# EAGLE design MUV_Interface_pcb (EAGLE 9.1.3)

## Sheet 1 of 2
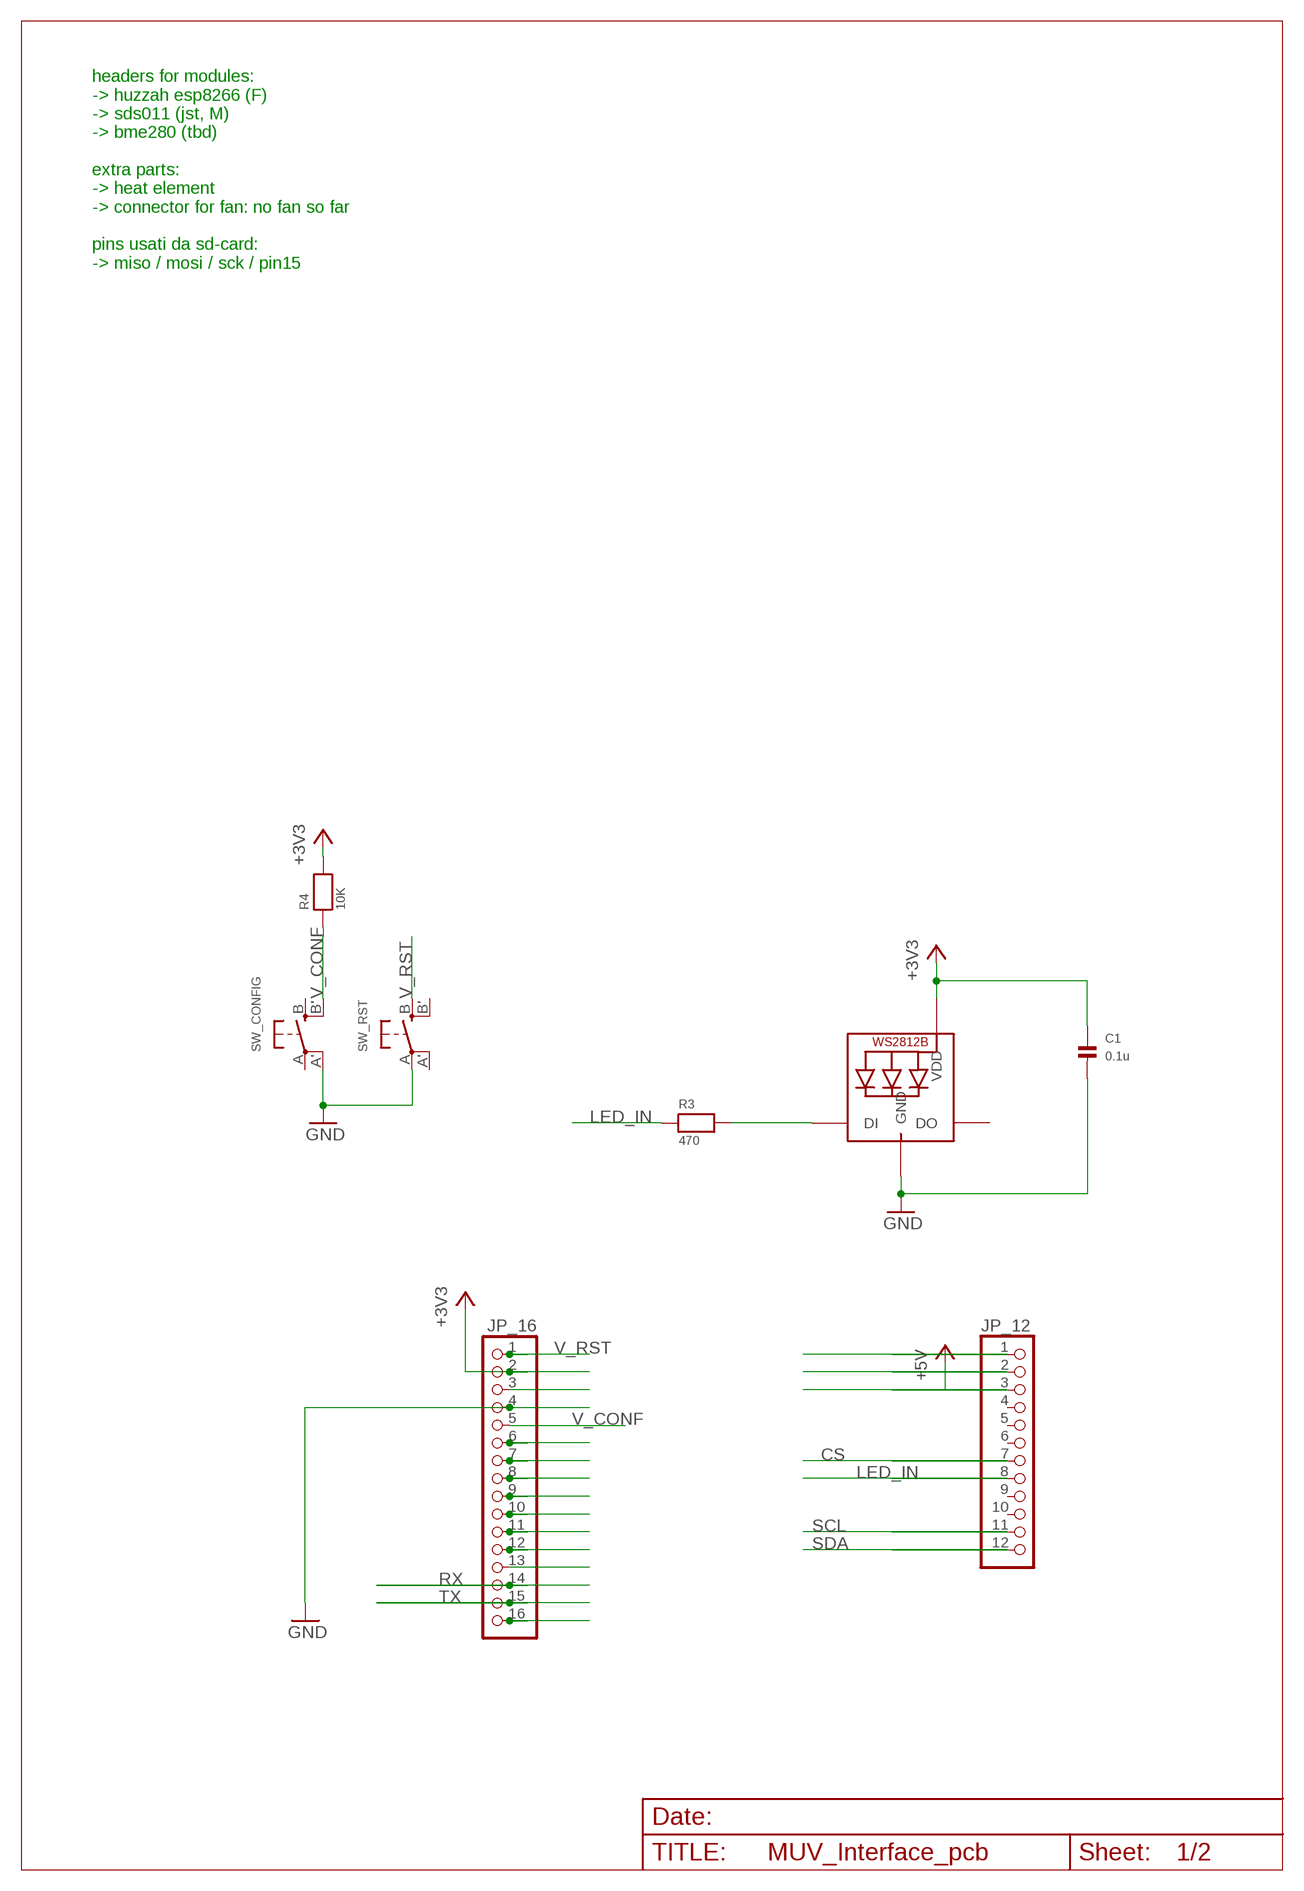
[diagram p0: schematic, sheet 1]

### Parts
C1  0.1u  CAP_CERAMIC1206  [1206]
JP_12  HEADER-1X12OVAL  [1X12_OVAL]
JP_16  HEADER-1X16  [1X16_OVAL]
LED1  WS2812B5050  [WS2812B]
R3  470  RESISTOR1206  [1206]
R4  10K  RESISTOR1206  [1206]
SW_CONFIG  SWITCH_TACT_SMT  [EVQ-Q2]
SW_RST  SWITCH_TACT_SMT  [EVQ-Q2]

### Nets
+3V3 [power]: C1.1 JP_16.2 LED1.1-VDD(VDD) R4.2
+5V [power_5V]: JP_12.3
CS: JP_12.7
GND [power]: C1.2 JP_16.4 LED1.3-GND(GND) SW_CONFIG.A'(P1) SW_RST.A(P)
LED_IN: JP_12.8 R3.1
N$1: JP_12.1
N$2: JP_12.2
N$3: LED1.4-DIN(DI) R3.2
N$11: JP_16.3
N$13: JP_16.6
N$14: JP_16.7
N$17: JP_16.8
N$18: JP_16.9
N$19: JP_16.10
N$20: JP_16.11
N$21: JP_16.12
N$22: JP_16.13
N$23: JP_16.16
RX: JP_16.14
SCL: JP_12.11
SDA: JP_12.12
TX: JP_16.15
V_CONF: JP_16.5 R4.1 SW_CONFIG.B'(S1)
V_RST: JP_16.1 SW_RST.B(S)
Unconnected: JP_12.4 JP_12.5 JP_12.6 JP_12.9 JP_12.10 LED1.2-DOUT(DO) SW_CONFIG.A(P) SW_CONFIG.B(S) SW_RST.A'(P1) SW_RST.B'(S1)

### Notes on the sheet
- headers for modules:
  -> huzzah esp8266 (F)
  -> sds011 (jst, M)
  -> bme280 (tbd)
  
  extra parts:
  -> heat element
  -> connector for fan: no fan so far
  
  pins usati da sd-card:
  -> miso / mosi / sck / pin15

## Sheet 2 of 2

## Library data of the parts
C1 = microbuilder:CAP_CERAMIC: Ceramic Capacitors 0402 - 0402 Surface Mount Capacitors 16pF 50V 5% [Digikey: 445-4899-2-ND] 18pF 50V 5% [Digikey: 490-1281-2-ND] 22pF 50V 5% [Digikey: 490-1283-2-ND] 68pF 50V 5% [Digikey: 490-1289-2-ND] 0.1uF 10V 10% [Digikey: 490-1318-2-ND] 1.0uF 6.3V 10% [Digikey: 490-1320-2-ND] 0603 - 0603 Surface Mount Capacitors 16 pF 50V 5% [Digikey: 445-5051-2-ND] 22 pF 50V [Digikey: PCC220ACVTR-ND] 33 pF 50V 5% [Digikey: 490-1415-1-ND] 56pF 50V 5% [Digikey: 490-1421-1-ND] 220pF 50V 5% [Digikey: 445-1285-1-ND] 680 pF 50V 2200 pF 50V 5% C0G [Digikey: 445-1297-1-ND] 5600 pF 100V 5% X7R [Digikey: 478-3711-1-ND] 0.1 µF 25V 10% [Digikey: PCC2277TR-ND] 0.22 µF 16V 10% X7R [Digikey: 445-1318-1-ND] 1.0 µF 25V 10% [Digikey: 445-5146-2-ND] 0603 - RF Specific 3pF 250V +/-0.1pF RF [Digikey: 712-1347-1-ND] 18 pF 250V 5% [Digikey: 478-3505-1-ND or 712-1322-1-ND] 56 pF 250V 5% C0G RF [Digikey: 490-4867-1-ND] 68 pF 250V RF [Digikey: 490-4868-1-ND] 0805 - 0805 Surface Mount Capacitors 220 pF 250V 2% RF Ceramic Capacitor [Digikey: 712-1398-1-ND] 1000 pF 50V 2% NP0 Ceramic Capacitor [Digikey: 478-3760-1-ND] 0.1 µF 25V 10% Ceramic Capacitor [Digikey: PCC1828TR-ND] 1.0 µF 16V 10% Ceramic Capacitor[Digikey: 490-1691-2-ND] 10.0 µF 10V 10% Ceramic Capacitor[Digikey: 709-1228-1-ND] 10.0 uF 16V 10% Ceramic Capacitor [Digikey: 478-5165-2-ND] 47 uF 6.3V 20% Ceramic Capacitor [Digikey: 587-1779-1-ND or 399-5506-1-ND] 1206 - 1206 Surface Mount Capacitors 47uF 10V 20% Ceramic Capacitor [Digikey: 490-5528-1-ND or 399-5508-1-ND or 445-6010-1-ND] 100uF 6.3V -20%, +80% Y5V Ceramic Capacitor (Digikey: 490-4512-1-ND, Mouser: 81-GRM31CF50J107ZE1L)
JP_12 = headers:HEADER-1X12
JP_16 = headers:HEADER-1X16: PIN HEADER
LED1 = adafruit:WS2812B
R3 R4 = microbuilder:RESISTOR: Resistors 0402 - 0402 Surface Mount Package 22 Ohm 1% 1/16W [Digikey: 311-22.0LRTR-ND] 33 Ohm 5% 1/16W 1.0K 5% 1/16W 1.5K 5% 1/16W 2.0K 1% 1/16W 10.0K 1% 1/16W [Digikey: 311-10.0KLRTR-ND] 10.0K 5% 1/16W [Digikey: RMCF0402JT10K0TR-ND] 12.1K 1% 1/16W [Digikey: 311-22.0LRTR-ND] 100.0K 5% 1/16W 0603 - 0603 Surface Mount Package 0 Ohm 1/10 Watt 1% Resistor 15 Ohm 1/10 Watt 1% Resistor 33 Ohm 1/10 Watt 1% Resistor 49.9 Ohm 1/10 Watt 1% Resistor 100 Ohm 1/10 Watt 1% Resistor 150 Ohm 1/10 Watt 1% Resistor 240 Ohm 1/10 Watt 1% Resistor 390 Ohm 1/10 Watt 1% Resistor 560 Ohm 1/10 Watt 1% Resistor 680 Ohm 1/10 Watt 1% Resistor 750 Ohm 1/10 Watt 1% Resistor 1.0K Ohm 1/10 Watt 1% Resistor 1.5K Ohm 1/10 Watt 1% Resistor 2.0K Ohm 1/10 Watt 1% Resistor 2.2K Ohm 1/10 Watt 1% Resistor 3.3K Ohm 1/10 Watt 1% Resistor 4.7K Ohm 1/10 Watt 1% Resistor 10.0K Ohm 1/10 Watt 1% Resistor 12.0K Ohm 1/10 Watt 1% Resistor 12.1K Ohm 1/10 Watt 1% Resistor 20.0K Ohm 1/10 Watt 1% Resistor 33.0K Ohm 1/10 Watt 1% Resistor 100.0K Ohm 1/10 Watt 1% Resistor 0805 - 0805 Surface Mount Package 0 Ohm 1/8 Watt 1% Resistor 33 Ohm 1/8 Watt 1% Resistor 100 Ohm 1/8 Watt 1% Resistor 150 Ohm 1/8 Watt 1% Resistor 200 Ohm 1/8 Watt 1% Resistor 240 Ohm 1/8 Watt 1% Resistor 330 Ohm 1/8 Watt 1% Resistor 390 Ohm 1/8 Watt 1% Resistor 470 Ohm 1/8 Watt 1% Resistor 1.0K Ohm 1/8 Watt 1% Resistor 1.5K Ohm 1/8 Watt 1% Resistor 2.0K Ohm 1/8 Watt 1% Resistor 4.7K Ohm 1/8 Watt 1% Resistor 5.1K Ohm 1/8 Watt 1% Resistor 5.6K Ohm 1/8 Watt 1% Resistor 10.0K Ohm 1/8 Watt 1% Resistor 22.0K Ohm 1/8 Watt 1% Resistor 33.0K Ohm 1/8 Watt 1% Resistor 100K Ohm 1/8 Watt 1% Resistor 1206 - 1206 Surface Mount Package 2012 - 2010 Surface Mount Package 0.11 Ohm 1/2 Watt 1% Resistor - Digikey: RHM.11UCT-ND
SW_CONFIG SW_RST = microbuilder:SWITCH_TACT_SMT: SMT Tact Switches 6x6mm - Digikey: P12940SCT-ND KMR2 (4.6x2.8mm) - Digikey: 401-1426-1-ND EVQ-PQHB55 - Light Touch, 160GF (4.5x4.5mm) - Digikey: P8090SCT-ND

## Net classes
0 default: width 0.3 mm, clearance 0.4 mm
1 power: width 0.3 mm, clearance 0.4 mm
2 power_5V: width 1 mm

## Board
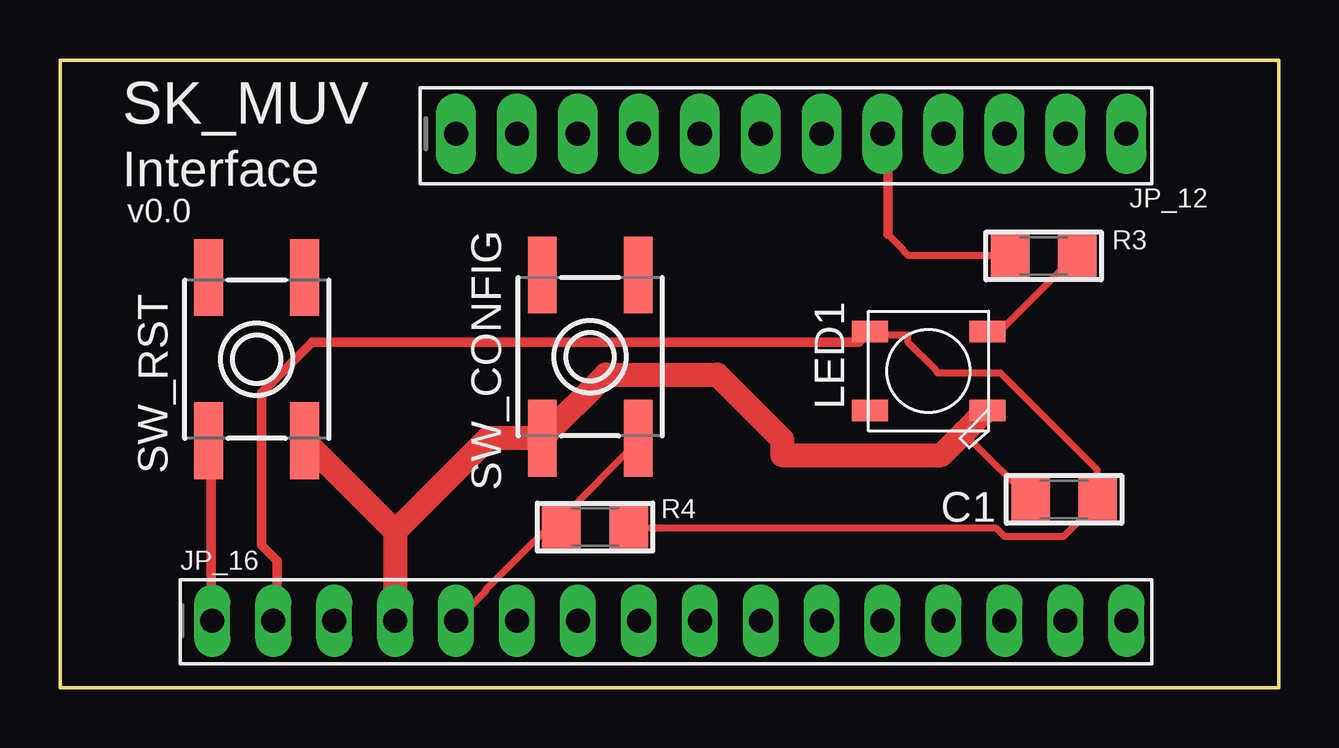
[diagram p1: board, top side]
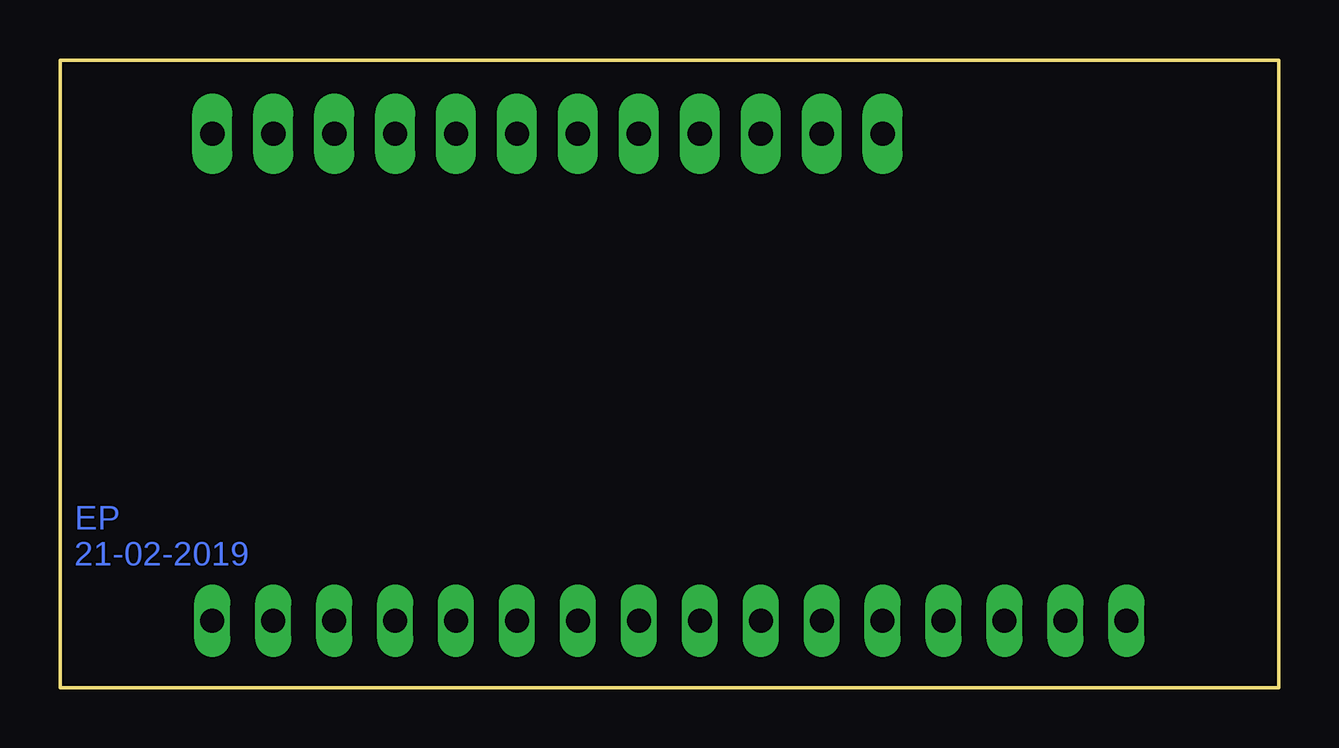
[diagram p2: board, bottom side, seen from below]

Size 50.8 x 26.16 mm. Coordinates in mm from the lower left corner, seen from the top.
Outline: 0,0 50.8,0
Outline: 0,0 0,23.37
Outline: 0,23.37 0,23.62
Outline: 0,23.37 0,26.16 50.8,26.16 50.8,0
Outline: 50.8,0 0,0
Copper layers (1*16): Top 0.035mm / dielectric 1.5mm / Bottom 0.035mm
Design rules "default *": minimum track width 6mil, minimum drill 0.35mm, track to track 0.4mm, track to pad 0.4mm, pad to pad 0.4mm, via to via 0.4mm, smd to smd 0.4mm, copper to edge 40mil, drill to drill 6mil, minimum pad ring 10mil, minimum via ring 8mil, stop-mask expansion 4mil, vias tented up to drill 0mil, thermal gap 10mil

### Footprints (pad centres in the part's own frame; a part is rotated, then mirrored left to right if it is on the bottom)
1206 = smd 1.6 x 1.8: 1 -1.4,0; 2 1.4,0
1X12_OVAL = drill 1.016 pad 1.676 long: 1 -13.97,0; 2 -11.43,0; 3 -8.89,0; 4 -6.35,0; 5 -3.81,0; 6 -1.27,0; 7 1.27,0; 8 3.81,0; 9 6.35,0; 10 8.89,0; 11 11.43,0; 12 13.97,0
1X16_OVAL = drill 1 long: 1 -19.05,0; 2 -16.51,0; 3 -13.97,0; 4 -11.43,0; 5 -8.89,0; 6 -6.35,0; 7 -3.81,0; 8 -1.27,0; 9 1.27,0; 10 3.81,0; 11 6.35,0; 12 8.89,0; 13 11.43,0; 14 13.97,0; 15 16.51,0; 16 19.05,0
WS2812B = smd 1.5 x 0.9: 1-VDD 2.45,-1.65; 2-DOUT 2.45,1.65; 3-GND -2.45,1.65; 4-DIN -2.45,-1.65
EVQ-Q2 = smd 3.2 x 1.2: A -3.4,-2; A' 3.4,-2; B -3.4,2; B' 3.4,2

### Placement (x,y rotation side)
C1  41.85,7.85 180 top
JP_12  30.48,23.09 0 top
JP_16  25.4,2.79 0 top
LED1  36.2,13.2 180 top
R3  41,18 0 top
R4  22.3,6.7 0 top
SW_CONFIG  22.1,13.8 270 top
SW_RST  8.2,13.7 90 top

### Tracks (layer width: path | path; a pad name or v marks a point on that pad's centre or on a via)
+3V3
  Top 0.3: 33.6,14.7 35.35,14.7 35.35,14.4 36.5,13.25 36.58,13.12 39.2,13.12 43.23,9.1 43.23,7.88 C1.1 43.23,7.7 41.83,6.3 39.38,6.3 39.02,6.65 23.8,6.65 R4.2
  Top 0.4: JP_16.2 9,3 9,3.6 9.05,3.65 9.05,5.3 8.4,5.95 8.4,7.55 8.4,12.3 10.5,14.4 33.3,14.4 33.6,14.7 LED1.1-VDD 33.9,14.7
GND
  Top 0.3: C1.2 40.42,7.88 37.98,10.32 37.67,10.63
  Top 0.4: 38.4,11.4 38.5,11.46 LED1.3-GND | 20.1,10.5 SW_CONFIG.A' 20.1,10.5
  Top 1: SW_RST.A 13.97,6.53 | 13.97,6.53 JP_16.4 | 13.97,6.53 17.84,10.4 SW_CONFIG.A' 22.75,13.05 27.4,13.05 30.1,10.35 30.1,9.7 36.74,9.7 37.67,10.63 38.5,11.46
LED_IN
  Top 0.3: 34.5,18.9 35.13,18.27 35.17,18.2 35.35,18.02 39.55,18.02 R3.1
  Top 0.4: 34.5,18.9 34.5,22.8 JP_12.8
N$3
  Top 0.3: 39.1,14.92 38.72,14.92 LED1.4-DIN 39.2,14.88 42.35,18.02 R3.2
  Top 0.4: 38.4,15 LED1.4-DIN
V_CONF
  Top 0.3: 16.6,2.88 JP_16.5 17.75,4.03 17.75,4.09 18.98,5.32 20.57,6.91 | 20.57,6.91 20.86,7.2 | 20.57,6.91 20.65,6.83 20.82,6.83 R4.1 21,7.17 23.98,10.15 SW_CONFIG.B'
  Top 0.4: 24,10.2 SW_CONFIG.B'
V_RST
  Top 0.4: JP_16.1 6.3,3 6.3,10.2 SW_RST.B

### Text on the board
Bottom: EP / 21-02-2019
tPlace: SK_MUV | Interface | v0.0